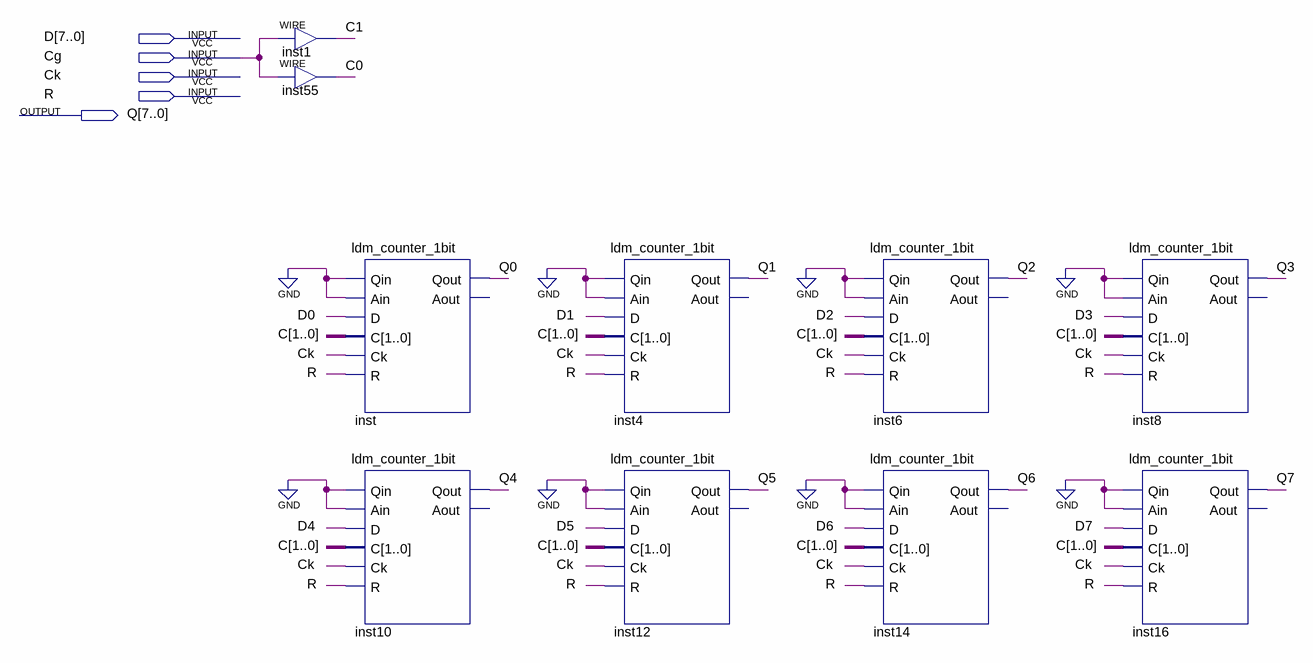
[diagram p0: schematic sheet]
// Quartus schematic ldm_reg_8bits.bdf as structural Verilog: 10 symbols, 5 pins
module ldm_reg_8bits (
  input  [7:0] D,
  input  Cg,
  input  Ck,
  input  R,
  output [7:0] Q
);

  wire [1:0] C;

  assign C[1] = Cg;  // WIRE inst1
  assign C[0] = Cg;  // WIRE inst55
  ldm_counter_1bit inst (.Qin(1'b0), .Ain(1'b0), .D(D[0]), .C(C), .Ck(Ck), .R(R), .Qout(Q[0]));  // open: Aout
  ldm_counter_1bit inst10 (.Qin(1'b0), .Ain(1'b0), .D(D[4]), .C(C), .Ck(Ck), .R(R), .Qout(Q[4]));  // open: Aout
  ldm_counter_1bit inst4 (.Qin(1'b0), .Ain(1'b0), .D(D[1]), .C(C), .Ck(Ck), .R(R), .Qout(Q[1]));  // open: Aout
  ldm_counter_1bit inst12 (.Qin(1'b0), .Ain(1'b0), .D(D[5]), .C(C), .Ck(Ck), .R(R), .Qout(Q[5]));  // open: Aout
  ldm_counter_1bit inst6 (.Qin(1'b0), .Ain(1'b0), .D(D[2]), .C(C), .Ck(Ck), .R(R), .Qout(Q[2]));  // open: Aout
  ldm_counter_1bit inst14 (.Qin(1'b0), .Ain(1'b0), .D(D[6]), .C(C), .Ck(Ck), .R(R), .Qout(Q[6]));  // open: Aout
  ldm_counter_1bit inst8 (.Qin(1'b0), .Ain(1'b0), .D(D[3]), .C(C), .Ck(Ck), .R(R), .Qout(Q[3]));  // open: Aout
  ldm_counter_1bit inst16 (.Qin(1'b0), .Ain(1'b0), .D(D[7]), .C(C), .Ck(Ck), .R(R), .Qout(Q[7]));  // open: Aout
endmodule
